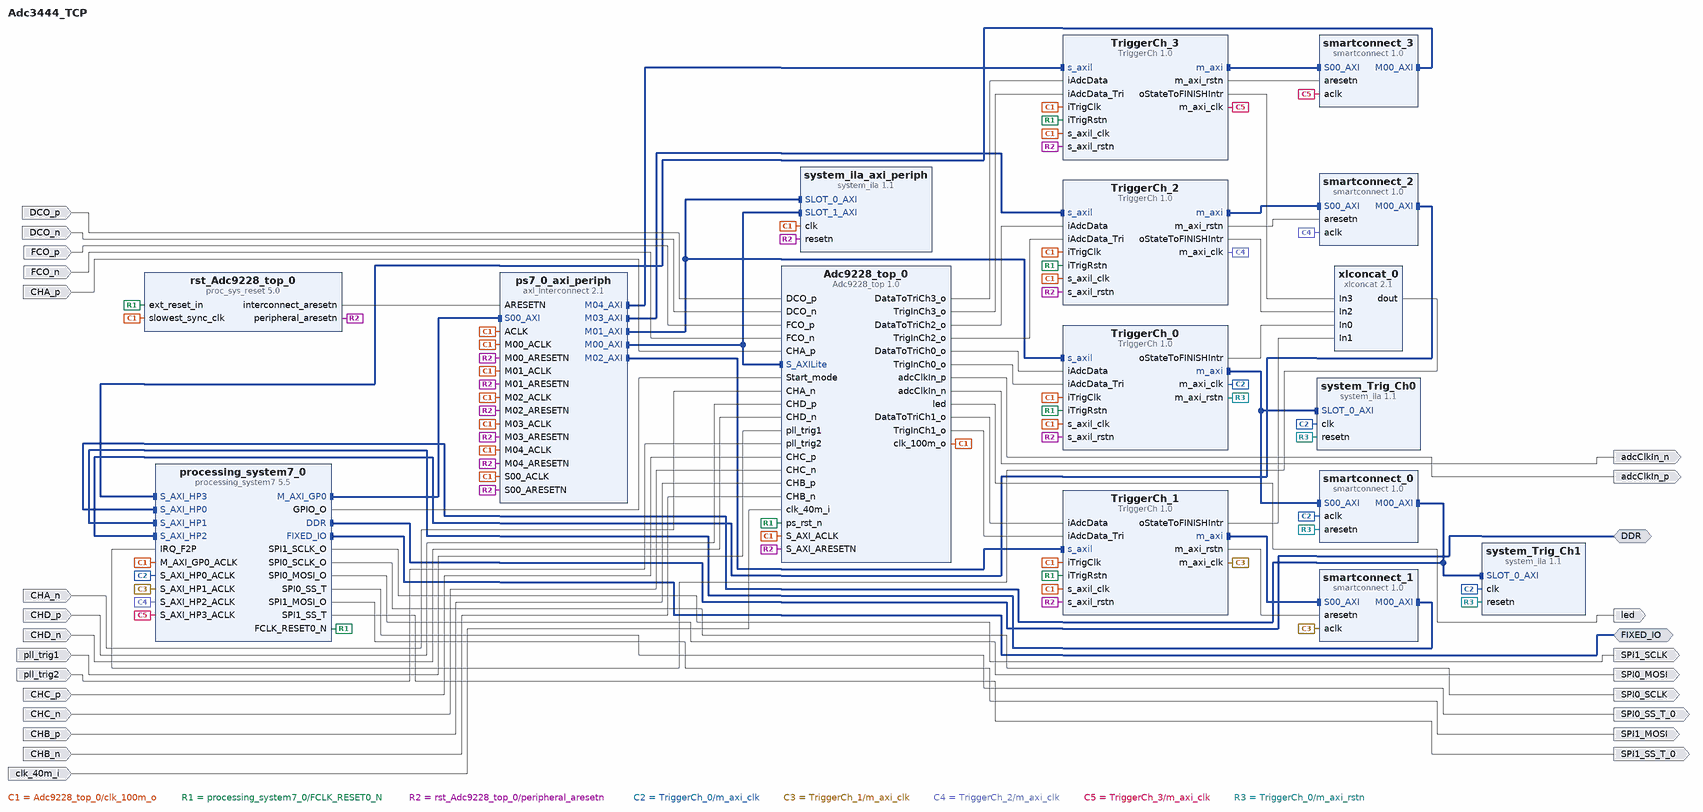
[diagram p0: block diagram of the top level]
# Vivado block design Adc3444_TCP, xc7z020clg400-1, Vivado 2017.4
create_bd_design Adc3444_TCP

create_bd_intf_port -mode Master -vlnv xilinx.com:interface:ddrx_rtl:1.0 DDR
create_bd_intf_port -mode Master -vlnv xilinx.com:display_processing_system7:fixedio_rtl:1.0 FIXED_IO
create_bd_port -dir O adcClkIn_p
create_bd_port -dir O adcClkIn_n
create_bd_port -dir O led
create_bd_port -dir I DCO_p
create_bd_port -dir I DCO_n
create_bd_port -dir I FCO_p
create_bd_port -dir I FCO_n
create_bd_port -dir I CHA_p
create_bd_port -dir I CHA_n
create_bd_port -dir I CHD_p
create_bd_port -dir I CHD_n
create_bd_port -dir I pll_trig1
create_bd_port -dir I pll_trig2
create_bd_port -dir I CHC_p
create_bd_port -dir I CHC_n
create_bd_port -dir I CHB_p
create_bd_port -dir I CHB_n
create_bd_port -dir O SPI1_SCLK
create_bd_port -dir O SPI0_SCLK
create_bd_port -dir O SPI0_MOSI
create_bd_port -dir O SPI0_SS_T_0
create_bd_port -dir O SPI1_MOSI
create_bd_port -dir O SPI1_SS_T_0
create_bd_port -dir I clk_40m_i

create_bd_cell -type ip -vlnv xilinx.com:ip:processing_system7:5.5 processing_system7_0
set_property -dict [list \
  CONFIG.PCW_UART_PERIPHERAL_FREQMHZ 100 \
  CONFIG.PCW_FPGA0_PERIPHERAL_FREQMHZ 200 \
  CONFIG.PCW_USE_S_AXI_HP0 1 \
  CONFIG.PCW_USE_S_AXI_HP1 1 \
  CONFIG.PCW_USE_S_AXI_HP2 1 \
  CONFIG.PCW_USE_S_AXI_HP3 1 \
  CONFIG.PCW_USE_FABRIC_INTERRUPT 1 \
  CONFIG.PCW_GPIO_EMIO_GPIO_WIDTH 1 \
  CONFIG.PCW_IRQ_F2P_INTR 1 \
  CONFIG.PCW_PRESET_BANK1_VOLTAGE {LVCMOS 1.8V} \
  CONFIG.PCW_UIPARAM_DDR_PARTNO {MT41K128M16 JT-125} \
  CONFIG.PCW_QSPI_PERIPHERAL_ENABLE 1 \
  CONFIG.PCW_QSPI_QSPI_IO {MIO 1 .. 6} \
  CONFIG.PCW_QSPI_GRP_SINGLE_SS_ENABLE 1 \
  CONFIG.PCW_QSPI_GRP_SINGLE_SS_IO {MIO 1 .. 6} \
  CONFIG.PCW_SINGLE_QSPI_DATA_MODE x4 \
  CONFIG.PCW_ENET0_PERIPHERAL_ENABLE 1 \
  CONFIG.PCW_ENET0_ENET0_IO {MIO 16 .. 27} \
  CONFIG.PCW_ENET0_GRP_MDIO_ENABLE 1 \
  CONFIG.PCW_ENET0_GRP_MDIO_IO {MIO 52 .. 53} \
  CONFIG.PCW_UART1_PERIPHERAL_ENABLE 1 \
  CONFIG.PCW_UART1_UART1_IO {MIO 48 .. 49} \
  CONFIG.PCW_SPI0_PERIPHERAL_ENABLE 1 \
  CONFIG.PCW_SPI0_SPI0_IO EMIO \
  CONFIG.PCW_SPI1_PERIPHERAL_ENABLE 1 \
  CONFIG.PCW_SPI1_SPI1_IO EMIO \
  CONFIG.PCW_GPIO_EMIO_GPIO_ENABLE 1 \
  CONFIG.PCW_GPIO_EMIO_GPIO_IO 1 \
] [get_bd_cells processing_system7_0]
# 116 more settings of processing_system7_0 are not shown: defaults, MIO pin electricals, DDR timing, and values the tool derives
create_bd_cell -type ip -vlnv xilinx.com:ip:axi_interconnect:2.1 ps7_0_axi_periph
set_property -dict {CONFIG.NUM_MI 5} [get_bd_cells ps7_0_axi_periph]
create_bd_cell -type ip -vlnv xilinx.com:ip:xlconcat:2.1 xlconcat_0
set_property -dict {CONFIG.NUM_PORTS 4} [get_bd_cells xlconcat_0]
create_bd_cell -type ip -vlnv xilinx.com:ip:proc_sys_reset:5.0 rst_Adc9228_top_0
create_bd_cell -type ip -vlnv xilinx.com:user:TriggerCh:1.0 TriggerCh_0
create_bd_cell -type ip -vlnv xilinx.com:user:TriggerCh:1.0 TriggerCh_1
create_bd_cell -type ip -vlnv xilinx.com:user:TriggerCh:1.0 TriggerCh_2
create_bd_cell -type ip -vlnv xilinx.com:user:TriggerCh:1.0 TriggerCh_3
create_bd_cell -type ip -vlnv xilinx.com:user:Adc9228_top:1.0 Adc9228_top_0
create_bd_cell -type ip -vlnv xilinx.com:ip:system_ila:1.1 system_Trig_Ch0
set_property -dict {CONFIG.C_DATA_DEPTH 2048 CONFIG.C_NUM_MONITOR_SLOTS 1} [get_bd_cells system_Trig_Ch0]
create_bd_cell -type ip -vlnv xilinx.com:ip:smartconnect:1.0 smartconnect_0
set_property -dict {CONFIG.NUM_SI 1} [get_bd_cells smartconnect_0]
create_bd_cell -type ip -vlnv xilinx.com:ip:smartconnect:1.0 smartconnect_1
set_property -dict {CONFIG.NUM_SI 1} [get_bd_cells smartconnect_1]
create_bd_cell -type ip -vlnv xilinx.com:ip:smartconnect:1.0 smartconnect_2
set_property -dict {CONFIG.NUM_SI 1} [get_bd_cells smartconnect_2]
create_bd_cell -type ip -vlnv xilinx.com:ip:smartconnect:1.0 smartconnect_3
set_property -dict {CONFIG.NUM_SI 1} [get_bd_cells smartconnect_3]
create_bd_cell -type ip -vlnv xilinx.com:ip:system_ila:1.1 system_ila_axi_periph
set_property -dict {CONFIG.C_DATA_DEPTH 2048 CONFIG.C_NUM_MONITOR_SLOTS 2} [get_bd_cells system_ila_axi_periph]
create_bd_cell -type ip -vlnv xilinx.com:ip:system_ila:1.1 system_Trig_Ch1
set_property -dict {CONFIG.C_DATA_DEPTH 2048 CONFIG.C_NUM_MONITOR_SLOTS 1} [get_bd_cells system_Trig_Ch1]

# ---- connections ----

connect_bd_intf_net [get_bd_intf_pins processing_system7_0/M_AXI_GP0] [get_bd_intf_pins ps7_0_axi_periph/S00_AXI]
connect_bd_intf_net [get_bd_intf_pins ps7_0_axi_periph/M00_AXI] [get_bd_intf_pins Adc9228_top_0/S_AXILite]
connect_bd_intf_net [get_bd_intf_pins ps7_0_axi_periph/M00_AXI] [get_bd_intf_pins system_ila_axi_periph/SLOT_1_AXI]
connect_bd_intf_net [get_bd_intf_pins ps7_0_axi_periph/M01_AXI] [get_bd_intf_pins TriggerCh_0/s_axil]
connect_bd_intf_net [get_bd_intf_pins ps7_0_axi_periph/M01_AXI] [get_bd_intf_pins system_ila_axi_periph/SLOT_0_AXI]
connect_bd_intf_net [get_bd_intf_pins ps7_0_axi_periph/M02_AXI] [get_bd_intf_pins TriggerCh_1/s_axil]
connect_bd_intf_net [get_bd_intf_pins ps7_0_axi_periph/M03_AXI] [get_bd_intf_pins TriggerCh_2/s_axil]
connect_bd_intf_net [get_bd_intf_pins ps7_0_axi_periph/M04_AXI] [get_bd_intf_pins TriggerCh_3/s_axil]
connect_bd_intf_net [get_bd_intf_pins smartconnect_0/S00_AXI] [get_bd_intf_pins TriggerCh_0/m_axi]
connect_bd_intf_net [get_bd_intf_pins smartconnect_0/S00_AXI] [get_bd_intf_pins system_Trig_Ch0/SLOT_0_AXI]
connect_bd_intf_net [get_bd_intf_pins smartconnect_0/M00_AXI] [get_bd_intf_pins processing_system7_0/S_AXI_HP0]
connect_bd_intf_net [get_bd_intf_pins smartconnect_0/M00_AXI] [get_bd_intf_pins system_Trig_Ch1/SLOT_0_AXI]
connect_bd_intf_net [get_bd_intf_pins smartconnect_1/S00_AXI] [get_bd_intf_pins TriggerCh_1/m_axi]
connect_bd_intf_net [get_bd_intf_pins smartconnect_1/M00_AXI] [get_bd_intf_pins processing_system7_0/S_AXI_HP1]
connect_bd_intf_net [get_bd_intf_pins smartconnect_2/M00_AXI] [get_bd_intf_pins processing_system7_0/S_AXI_HP2]
connect_bd_intf_net [get_bd_intf_pins smartconnect_2/S00_AXI] [get_bd_intf_pins TriggerCh_2/m_axi]
connect_bd_intf_net [get_bd_intf_pins smartconnect_3/M00_AXI] [get_bd_intf_pins processing_system7_0/S_AXI_HP3]
connect_bd_intf_net [get_bd_intf_pins smartconnect_3/S00_AXI] [get_bd_intf_pins TriggerCh_3/m_axi]
connect_bd_intf_net [get_bd_intf_ports DDR] [get_bd_intf_pins processing_system7_0/DDR]
connect_bd_intf_net [get_bd_intf_ports FIXED_IO] [get_bd_intf_pins processing_system7_0/FIXED_IO]
connect_bd_net -net Adc9228_top_0_clk_10m_o [get_bd_pins Adc9228_top_0/clk_100m_o] \
  [get_bd_pins processing_system7_0/M_AXI_GP0_ACLK] [get_bd_pins rst_Adc9228_top_0/slowest_sync_clk] \
  [get_bd_pins TriggerCh_0/s_axil_clk] [get_bd_pins TriggerCh_0/iTrigClk] [get_bd_pins TriggerCh_1/s_axil_clk] \
  [get_bd_pins TriggerCh_1/iTrigClk] [get_bd_pins TriggerCh_2/s_axil_clk] [get_bd_pins TriggerCh_2/iTrigClk] \
  [get_bd_pins TriggerCh_3/s_axil_clk] [get_bd_pins TriggerCh_3/iTrigClk] [get_bd_pins ps7_0_axi_periph/ACLK] \
  [get_bd_pins ps7_0_axi_periph/S00_ACLK] [get_bd_pins ps7_0_axi_periph/M00_ACLK] [get_bd_pins ps7_0_axi_periph/M01_ACLK] \
  [get_bd_pins ps7_0_axi_periph/M02_ACLK] [get_bd_pins ps7_0_axi_periph/M03_ACLK] [get_bd_pins ps7_0_axi_periph/M04_ACLK] \
  [get_bd_pins Adc9228_top_0/S_AXI_ACLK] [get_bd_pins system_ila_axi_periph/clk]
connect_bd_net -net Adc9228_top_0_DataToTriCh0 [get_bd_pins Adc9228_top_0/DataToTriCh0_o] [get_bd_pins TriggerCh_0/iAdcData]
connect_bd_net -net Adc9228_top_0_DataToTriCh1 [get_bd_pins Adc9228_top_0/DataToTriCh1_o] [get_bd_pins TriggerCh_1/iAdcData]
connect_bd_net -net Adc9228_top_0_DataToTriCh2 [get_bd_pins Adc9228_top_0/DataToTriCh2_o] [get_bd_pins TriggerCh_2/iAdcData]
connect_bd_net -net Adc9228_top_0_TrigInCh0 [get_bd_pins Adc9228_top_0/TrigInCh0_o] [get_bd_pins TriggerCh_0/iAdcData_Tri]
connect_bd_net -net Adc9228_top_0_DataToTriCh3 [get_bd_pins Adc9228_top_0/DataToTriCh3_o] [get_bd_pins TriggerCh_3/iAdcData]
connect_bd_net -net Adc9228_top_0_TrigInCh1 [get_bd_pins Adc9228_top_0/TrigInCh1_o] [get_bd_pins TriggerCh_1/iAdcData_Tri]
connect_bd_net -net Adc9228_top_0_TrigInCh2 [get_bd_pins Adc9228_top_0/TrigInCh2_o] [get_bd_pins TriggerCh_2/iAdcData_Tri]
connect_bd_net -net Adc9228_top_0_TrigInCh3 [get_bd_pins Adc9228_top_0/TrigInCh3_o] [get_bd_pins TriggerCh_3/iAdcData_Tri]
connect_bd_net [get_bd_pins Adc9228_top_0/adcClkIn_p] [get_bd_ports adcClkIn_p]
connect_bd_net [get_bd_pins Adc9228_top_0/adcClkIn_n] [get_bd_ports adcClkIn_n]
connect_bd_net [get_bd_pins Adc9228_top_0/led] [get_bd_ports led]
connect_bd_net -net DCO_p_0_1 [get_bd_ports DCO_p] [get_bd_pins Adc9228_top_0/DCO_p]
connect_bd_net -net DCO_n_0_1 [get_bd_ports DCO_n] [get_bd_pins Adc9228_top_0/DCO_n]
connect_bd_net -net FCO_p_0_1 [get_bd_ports FCO_p] [get_bd_pins Adc9228_top_0/FCO_p]
connect_bd_net -net FCO_n_0_1 [get_bd_ports FCO_n] [get_bd_pins Adc9228_top_0/FCO_n]
connect_bd_net -net CHA_p_0_1 [get_bd_ports CHA_p] [get_bd_pins Adc9228_top_0/CHA_p]
connect_bd_net -net CHA_n_0_1 [get_bd_ports CHA_n] [get_bd_pins Adc9228_top_0/CHA_n]
connect_bd_net -net CHD_p_0_1 [get_bd_ports CHD_p] [get_bd_pins Adc9228_top_0/CHD_p]
connect_bd_net -net CHD_n_0_1 [get_bd_ports CHD_n] [get_bd_pins Adc9228_top_0/CHD_n]
connect_bd_net -net pll_trig1_0_1 [get_bd_ports pll_trig1] [get_bd_pins Adc9228_top_0/pll_trig1]
connect_bd_net -net pll_trig2_0_1 [get_bd_ports pll_trig2] [get_bd_pins Adc9228_top_0/pll_trig2]
connect_bd_net -net CHC_p_0_1 [get_bd_ports CHC_p] [get_bd_pins Adc9228_top_0/CHC_p]
connect_bd_net -net CHC_n_0_1 [get_bd_ports CHC_n] [get_bd_pins Adc9228_top_0/CHC_n]
connect_bd_net -net CHB_p_0_1 [get_bd_ports CHB_p] [get_bd_pins Adc9228_top_0/CHB_p]
connect_bd_net -net CHB_n_0_1 [get_bd_ports CHB_n] [get_bd_pins Adc9228_top_0/CHB_n]
connect_bd_net [get_bd_pins processing_system7_0/FCLK_RESET0_N] \
  [get_bd_pins rst_Adc9228_top_0/ext_reset_in] [get_bd_pins TriggerCh_0/iTrigRstn] [get_bd_pins TriggerCh_1/iTrigRstn] \
  [get_bd_pins TriggerCh_2/iTrigRstn] [get_bd_pins TriggerCh_3/iTrigRstn] [get_bd_pins Adc9228_top_0/ps_rst_n]
connect_bd_net [get_bd_pins TriggerCh_0/oStateToFINISHIntr] [get_bd_pins xlconcat_0/In0]
connect_bd_net [get_bd_pins TriggerCh_1/oStateToFINISHIntr] [get_bd_pins xlconcat_0/In1]
connect_bd_net [get_bd_pins TriggerCh_2/oStateToFINISHIntr] [get_bd_pins xlconcat_0/In2]
connect_bd_net [get_bd_pins TriggerCh_3/oStateToFINISHIntr] [get_bd_pins xlconcat_0/In3]
connect_bd_net [get_bd_pins xlconcat_0/dout] [get_bd_pins processing_system7_0/IRQ_F2P]
connect_bd_net [get_bd_pins processing_system7_0/SPI1_SCLK_O] [get_bd_ports SPI1_SCLK]
connect_bd_net [get_bd_pins processing_system7_0/SPI0_SCLK_O] [get_bd_ports SPI0_SCLK]
connect_bd_net [get_bd_pins processing_system7_0/SPI0_MOSI_O] [get_bd_ports SPI0_MOSI]
connect_bd_net [get_bd_pins processing_system7_0/SPI0_SS_T] [get_bd_ports SPI0_SS_T_0]
connect_bd_net [get_bd_pins processing_system7_0/SPI1_MOSI_O] [get_bd_ports SPI1_MOSI]
connect_bd_net [get_bd_pins processing_system7_0/SPI1_SS_T] [get_bd_ports SPI1_SS_T_0]
connect_bd_net -net M02_ARESETN_1 [get_bd_pins rst_Adc9228_top_0/peripheral_aresetn] \
  [get_bd_pins TriggerCh_0/s_axil_rstn] [get_bd_pins TriggerCh_1/s_axil_rstn] [get_bd_pins TriggerCh_2/s_axil_rstn] \
  [get_bd_pins TriggerCh_3/s_axil_rstn] [get_bd_pins ps7_0_axi_periph/M02_ARESETN] [get_bd_pins ps7_0_axi_periph/M03_ARESETN] \
  [get_bd_pins ps7_0_axi_periph/M04_ARESETN] [get_bd_pins ps7_0_axi_periph/M01_ARESETN] \
  [get_bd_pins ps7_0_axi_periph/M00_ARESETN] [get_bd_pins ps7_0_axi_periph/S00_ARESETN] \
  [get_bd_pins Adc9228_top_0/S_AXI_ARESETN] [get_bd_pins system_ila_axi_periph/resetn]
connect_bd_net [get_bd_pins processing_system7_0/GPIO_O] [get_bd_pins Adc9228_top_0/Start_mode]
connect_bd_net -net ARESETN_1 [get_bd_pins rst_Adc9228_top_0/interconnect_aresetn] [get_bd_pins ps7_0_axi_periph/ARESETN]
connect_bd_net [get_bd_ports clk_40m_i] [get_bd_pins Adc9228_top_0/clk_40m_i]
connect_bd_net [get_bd_pins TriggerCh_0/m_axi_clk] \
  [get_bd_pins processing_system7_0/S_AXI_HP0_ACLK] [get_bd_pins smartconnect_0/aclk] [get_bd_pins system_Trig_Ch0/clk] \
  [get_bd_pins system_Trig_Ch1/clk]
connect_bd_net [get_bd_pins TriggerCh_1/m_axi_clk] [get_bd_pins processing_system7_0/S_AXI_HP1_ACLK] [get_bd_pins smartconnect_1/aclk]
connect_bd_net [get_bd_pins TriggerCh_2/m_axi_clk] [get_bd_pins processing_system7_0/S_AXI_HP2_ACLK] [get_bd_pins smartconnect_2/aclk]
connect_bd_net [get_bd_pins TriggerCh_3/m_axi_clk] [get_bd_pins processing_system7_0/S_AXI_HP3_ACLK] [get_bd_pins smartconnect_3/aclk]
connect_bd_net [get_bd_pins TriggerCh_0/m_axi_rstn] \
  [get_bd_pins smartconnect_0/aresetn] [get_bd_pins system_Trig_Ch0/resetn] [get_bd_pins system_Trig_Ch1/resetn]
connect_bd_net [get_bd_pins TriggerCh_1/m_axi_rstn] [get_bd_pins smartconnect_1/aresetn]
connect_bd_net [get_bd_pins TriggerCh_2/m_axi_rstn] [get_bd_pins smartconnect_2/aresetn]
connect_bd_net [get_bd_pins TriggerCh_3/m_axi_rstn] [get_bd_pins smartconnect_3/aresetn]

# ---- address map ----
assign_bd_address -offset 0x40000000 -range 64M -target_address_space [get_bd_addr_spaces processing_system7_0/Data] [get_bd_addr_segs TriggerCh_0/s_axil/reg0]
assign_bd_address -offset 0x44010000 -range 64K -target_address_space [get_bd_addr_spaces processing_system7_0/Data] [get_bd_addr_segs Adc9228_top_0/S_AXILite/reg0]
assign_bd_address -offset 0x50000000 -range 64M -target_address_space [get_bd_addr_spaces processing_system7_0/Data] [get_bd_addr_segs TriggerCh_2/s_axil/reg0]
assign_bd_address -offset 0x60000000 -range 64M -target_address_space [get_bd_addr_spaces processing_system7_0/Data] [get_bd_addr_segs TriggerCh_1/s_axil/reg0]
assign_bd_address -offset 0x70000000 -range 64M -target_address_space [get_bd_addr_spaces processing_system7_0/Data] [get_bd_addr_segs TriggerCh_3/s_axil/reg0]
assign_bd_address -offset 0x00000000 -range 512M -target_address_space [get_bd_addr_spaces TriggerCh_0/m_axi] [get_bd_addr_segs processing_system7_0/S_AXI_HP0/HP0_DDR_LOWOCM]
assign_bd_address -offset 0x00000000 -range 512M -target_address_space [get_bd_addr_spaces TriggerCh_1/m_axi] [get_bd_addr_segs processing_system7_0/S_AXI_HP1/HP1_DDR_LOWOCM]
assign_bd_address -offset 0x00000000 -range 512M -target_address_space [get_bd_addr_spaces TriggerCh_2/m_axi] [get_bd_addr_segs processing_system7_0/S_AXI_HP2/HP2_DDR_LOWOCM]
assign_bd_address -offset 0x00000000 -range 512M -target_address_space [get_bd_addr_spaces TriggerCh_3/m_axi] [get_bd_addr_segs processing_system7_0/S_AXI_HP3/HP3_DDR_LOWOCM]

validate_bd_design
save_bd_design
